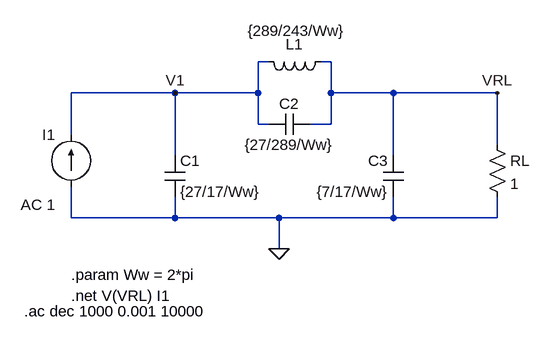
[diagram p0: schematic Ej2.asc]
Ej2.asc, the LTspice schematic file:
Version 4
SHEET 1 880 680
WIRE 288 0 272 0
WIRE 384 0 368 0
WIRE 144 48 -16 48
WIRE 272 48 272 0
WIRE 272 48 144 48
WIRE 384 48 384 0
WIRE 480 48 384 48
WIRE 640 48 480 48
WIRE 272 96 272 48
WIRE 288 96 272 96
WIRE 384 96 384 48
WIRE 384 96 352 96
WIRE -16 112 -16 48
WIRE 640 128 640 48
WIRE 144 144 144 48
WIRE 480 144 480 48
WIRE -16 240 -16 192
WIRE 144 240 144 208
WIRE 144 240 -16 240
WIRE 304 240 144 240
WIRE 480 240 480 208
WIRE 480 240 304 240
WIRE 640 240 640 208
WIRE 640 240 480 240
WIRE 304 288 304 240
FLAG 304 288 0
FLAG 144 48 V1
FLAG 640 48 VRL
SYMBOL cap 128 144 R0
SYMATTR InstName C1
SYMATTR Value {27/17/Ww}
SYMBOL cap 352 80 R90
WINDOW 0 0 32 VBottom 2
WINDOW 3 32 32 VTop 2
SYMATTR InstName C2
SYMATTR Value {27/289/Ww}
SYMBOL cap 496 208 R180
WINDOW 0 24 56 Left 2
WINDOW 3 24 8 Left 2
SYMATTR InstName C3
SYMATTR Value {7/17/Ww}
SYMBOL ind 384 -16 R90
WINDOW 0 5 56 VBottom 2
WINDOW 3 -47 53 VTop 2
SYMATTR InstName L1
SYMATTR Value {289/243/Ww}
SYMBOL res 624 112 R0
SYMATTR InstName RL
SYMATTR Value 1
SYMBOL current -16 192 R180
WINDOW 0 24 80 Left 2
WINDOW 3 24 0 Left 2
WINDOW 123 24 -28 Left 2
WINDOW 39 0 0 Left 0
SYMATTR InstName I1
SYMATTR Value ""
SYMATTR Value2 AC 1
TEXT -16 328 Left 2 !.param Ww = 2*pi
TEXT -16 360 Left 2 !.net V(VRL) I1
TEXT -88 384 Left 2 !.ac dec 1000 0.001 10000

The netlist it stands for:
* Ej2.asc
C1 V1 0 {27/17/Ww}
C2 VRL V1 {27/289/Ww}
C3 0 VRL {7/17/Ww}
L1 VRL V1 {289/243/Ww}
RL VRL 0 1
I1 0 V1 AC 1
.param Ww = 2*pi
.net V(VRL) I1
.ac dec 1000 0.001 10000
.backanno
.end